# Altium schematic sheet Sheet1.SchDoc
size A4
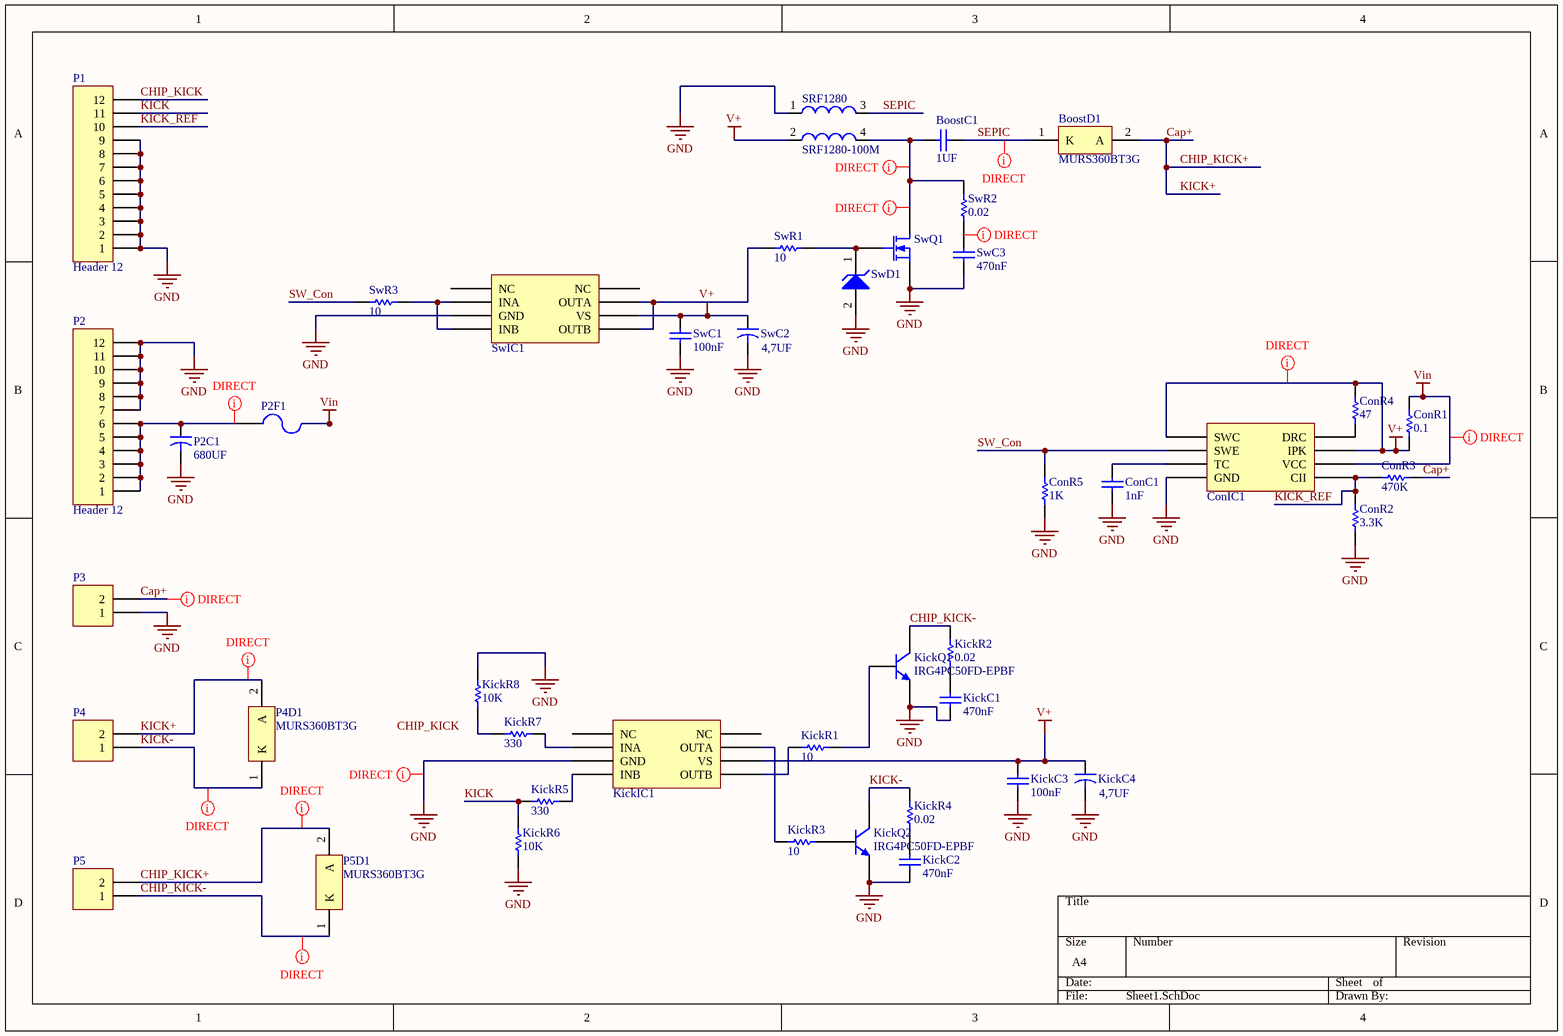
[diagram p0: Sheet1.SchDoc]

## Parts
BoostC1  value 1UF  [CAP-2220]  (hidden comment: CGA9P4X7T2W105M250KE)
BoostD1  MURS360BT3G  [ONSC-SMB-2-403A-03_V]
ConC1  value 1nF  [CAP-0402]  (hidden comment: GRM155R71H102KA01D)
ConIC1  MC34063ACD  [SOIC8-STM]  (value not drawn)
ConR1  value 0.1  [RES-2512 BOURNS CRA]  (hidden comment: CRA2512-FZ-R100ELF)
ConR2  value 3.3K  [RES-1206]  (hidden comment: RC1206JR-073K3L)
ConR3  value 470K  [RES-1206]  (hidden comment: RC1206FR-07470KL)
ConR4  value 47  [RES-0402]  (hidden comment: RC0402JR-0747RL)
ConR5  value 1K  [RES-0402]  (hidden comment: RC0402JR-071KL)
KickC1  value 470nF  [CAP-1812 TDK]  (hidden comment: C4532X7R2E474K230KA)
KickC2  value 470nF  [CAP-1812 TDK]  (hidden comment: C4532X7R2E474K230KA)
KickC3  value 100nF  [CAP-0402]  (hidden comment: GRM155R71C104KA88D)
KickC4  value 4,7UF  [CAP Tant 1206 Kemet]  (hidden comment: T491A475M025AT)
KickIC1  IR4427STRPBF  [SOIC8-INFINEON]  (value not drawn)
KickQ1  IRG4PC50FD-EPBF  [TO-247AC]
KickQ2  IRG4PC50FD-EPBF  [TO-247AC]
KickR1  value 10  [RES-0402]  (hidden comment: RC0402JR-0710RL)
KickR2  value 0.02  [RES-1206]  (hidden comment: PF1206FRF070R02L)
KickR3  value 10  [RES-0402]  (hidden comment: RC0402JR-0710RL)
KickR4  value 0.02  [RES-1206]  (hidden comment: PF1206FRF070R02L)
KickR5  value 330  [RES-0402]  (hidden comment: RC0402JR-07330RL)
KickR6  value 10K  [RES-0402]  (hidden comment: RC0402JR-0710KL)
KickR7  value 330  [RES-0402]  (hidden comment: RC0402JR-07330RL)
KickR8  value 10K  [RES-0402]  (hidden comment: RC0402JR-0710KL)
P1  Header 12  [HDR1X12]
P2  Header 12  [HDR1X12]
P2C1  value 680UF  [Cap Al Size G - Panasonic]  (hidden comment: EEE-FK1C681GP)
P2F1  MF-MSMF250/16X-2  [1812-MSMF Bourns2]  (value not drawn)
P3  OSTTA024163  [Term Block 2P]  (value not drawn)
P4  OSTTA024163  [Term Block 2P]  (value not drawn)
P4D1  MURS360BT3G  [ONSC-SMB-2-403A-03_V]
P5  OSTTA024163  [Term Block 2P]  (value not drawn)
P5D1  MURS360BT3G  [ONSC-SMB-2-403A-03_V]
SRF1280  SRF1280-100M  [SRF1280-100M-PCB]
SwC1  value 100nF  [CAP-0402]  (hidden comment: GRM155R71C104KA88D)
SwC2  value 4,7UF  [CAP Tant 1206 Kemet]  (hidden comment: T491A475M025AT)
SwC3  value 470nF  [CAP-1206 KEMET]  (hidden comment: C1206C474K5NACTU)
SwD1  MMSZ18T1G  [ONSC-SOD-123-2-425-04_V]  (value not drawn)
SwIC1  IR4427STRPBF  [SOIC8-INFINEON]  (value not drawn)
SwQ1  SUM45N25-58-E3  [TO-263 Vishay]  (value not drawn)
SwR1  value 10  [RES-0402]  (hidden comment: RC0402JR-0710RL)
SwR2  value 0.02  [RES-1206]  (hidden comment: PF1206FRF070R02L)
SwR3  value 10  [RES-0402]  (hidden comment: RC0402JR-0710RL)

## Nets
GND: ConC1.1 ConIC1.4(GND) ConR2.1 ConR5.1 KickC1.1 KickC2.1 KickC3.1 KickC4.2 KickIC1.3(GND) KickQ1.3(E) KickQ2.3(E) KickR6.1 KickR8.1 P1.1 P1.2 P1.3 P1.4 P1.5 P1.6 P1.7 P1.8 P1.9 P2.7 P2.8 P2.9 P2.10 P2.11 P2.12 P2C1.2 P3.1 SRF1280.1 SwC1.1 SwC2.2 SwC3.1 SwD1.2(A) SwIC1.3(GND) SwQ1.3(S)
V+: ConIC1.1(SWC) ConIC1.7(IPK) ConR1.1 ConR4.2 KickC3.2 KickC4.1 KickIC1.6(VS) SRF1280.2 SwC1.2 SwC2.1 SwIC1.6(VS)
Vin: ConIC1.6(VCC) ConR1.2 P2F1.2
Cap+: BoostD1.2(A) ConR3.2 P3.2 P4.2 P4D1.2(A) P5.2 P5D1.2(A)  [also labelled CHIP_KICK+, KICK+]
CHIP_KICK: P1.12
CHIP_KICK-: KickQ1.2(C) KickR2.2 P5.1 P5D1.1(K)
KICK: KickR5.1 KickR6.2 P1.11
KICK-: KickQ2.2(C) KickR4.2 P4.1 P4D1.1(K)
KICK_REF: ConIC1.5(CII) ConR2.2 ConR3.1 P1.10
SEPIC: BoostC1.2 BoostD1.1(K) SRF1280.3
SW_Con: ConIC1.2(SWE) ConR5.2 SwR3.1
NetBoostC1_1: BoostC1.1 SRF1280.4 SwQ1.2(D) SwR2.2
NetConC1_2: ConC1.2 ConIC1.3(TC)
NetConIC1_8: ConIC1.8(DRC) ConR4.1
NetKickC1_2: KickC1.2 KickR2.1
NetKickC2_2: KickC2.2 KickR4.1
NetKickIC1_2: KickIC1.2(INA) KickR7.2
NetKickIC1_4: KickIC1.4(INB) KickR5.2
NetKickIC1_5: KickIC1.5(OUTB) KickR1.1
NetKickIC1_7: KickIC1.7(OUTA) KickR3.1
NetKickQ1_1: KickQ1.1(B) KickR1.2
NetKickQ2_1: KickQ2.1(B) KickR3.2
NetKickR7_1: KickR7.1 KickR8.2
NetP2_1: P2.1 P2.2 P2.3 P2.4 P2.5 P2.6 P2C1.1 P2F1.1
NetSwC3_2: SwC3.2 SwR2.1
NetSwD1_1: SwD1.1(K) SwQ1.1(G) SwR1.2
NetSwIC1_2: SwIC1.2(INA) SwIC1.4(INB) SwR3.2
NetSwIC1_5: SwIC1.5(OUTB) SwIC1.7(OUTA) SwR1.1

Not connected (* = marked no-connect by the designer): KickIC1 1(NC) 8(NC); SwIC1 1(NC) 8(NC)

## Layout directives
net class DIRECT: Cap+, CHIP_KICK-, GND, KICK-, NetBoostC1_1, NetP2_1, NetSwC3_2, SEPIC, V+, Vin

## Notes on the sheet
- Labels drawn without touching a wire or pin: CHIP_KICK

## Library data of the parts
BoostC1 = Cap 1UF 2220 450V: 1µF 450V Ceramic Capacitor X7T 2220 (5750 Metric) 0.224" L x 0.197" W (5.70mm x 5.00mm)
BoostD1 P4D1 P5D1 = CMP-0902-00327-1: Surface Mount Ultrafast Power Rectifier, 2-Pin SMB, Pb-Free, Tape and Reel; Manufacturer: On Semiconductor; VRRM Max (V): 600; IFSM Max (A): 100; PackageVersion: Rev. J, 07/2012; ComponentLink3Description: Package Specification; ComponentLink2URL: http://www.onsemi.cn/pub_link/Collateral/MURS360BT3-D.PDF; PackageDescription: 2-Pin Small Molded Package, J-Bend Lead, Body 4.33 x 3.625 mm; Type: Ultrafast; RoHS: TRUE; Mounting Technology: Surface Mount; Packing: Tape and Reel; ComponentLink2Description: Datasheet; ComponentLink1URL: http://www.onsemi.com/; DatasheetVersion: Rev. 5; PartNumber: MURS360BT3G; ComponentLink3URL: http://www.onsemi.com/pub_link/Collateral/403A-03.PDF; PackageReference: SMB-2-403A-03; ComponentLink1Description: Manufacturer URL
ConC1 = Cap 1nF 0402: 1000pF 50V Ceramic Capacitor X7R 0402 (1005 Metric) 0.039" L x 0.020" W (1.00mm x 0.50mm)
ConIC1 = MC34063ACD: Buck, Boost Switching Regulator IC Positive or Negative Adjustable 1.25V 1 Output 1.5A (Switch) 8-SOIC (0.154", 3.90mm Width)
ConR1 = RES 0R1 2512: RES SMD 0.1 OHM 1% 3W 2512
ConR2 = RES 3.3K 1206: RES SMD 3.3K OHM 5% 1/4W 1206
ConR3 = RES 470K 1206: RES SMD 470K OHM 1% 1/4W 1206
ConR4 = RES 47 0402: RES SMD 47 OHM 5% 1/16W 0402
ConR5 = RES 1K 0402: RES SMD 1K OHM 5% 1/16W 0402
KickC1 KickC2 = Cap 470nF 250V 1812: 0.47µF 250V Ceramic Capacitor X7R 1812 (4532 Metric) 0.177" L x 0.126" W (4.50mm x 3.20mm)
KickC3 SwC1 = Cap 100nF 0402: 0.10µF 16V Ceramic Capacitor X7R 0402 (1005 Metric) 0.039" L x 0.020" W (1.00mm x 0.50mm)
KickC4 SwC2 = Cap Tant 4,7UF 1206: 4.7µF Molded Tantalum Capacitors 25V 1206 (3216 Metric) 6 Ohm 0.126" L x 0.063" W (3.20mm x 1.60mm)
KickIC1 SwIC1 = IR4427: IC DRIVER DUAL LOW SIDE 8SOIC
KickQ1 KickQ2 = IRG4PC50FD: IGBT 600V 70A 200W TO247AD
KickR1 KickR3 SwR1 SwR3 = RES 10 0402: RES SMD 10 OHM 5% 1/16W 0402
KickR2 KickR4 SwR2 = RES 0R02 1206: RES SMD 0.02 OHM 1% 1/4W 1206
KickR5 KickR7 = RES 330 0402: RES SMD 330 OHM 5% 1/16W 0402
KickR6 KickR8 = RES 10K 0402: RES SMD 10K OHM 5% 1/16W 0402
P1 P2 = Header 12: Header, 12-Pin; LatestRevisionDate: 17-Jul-2002; LatestRevisionNote: Re-released for DXP Platform.; Publisher: Altium Limited
P2C1 = CAP AL 680UF/16V: Aluminum Electrolytic Capacitors - SMD Al Lytic Cap SMT FK Series 105C
P2F1 = MF-MSMF250/16X: PTC RESETTABLE
P3-P5 = Term Block 2P: 2 Position Wire to Board Terminal Block Horizontal with Board 0.200" (5.08mm) Through Hole
SRF1280 = SRF1280-100M: Shielded 2 Coil Inductor Array 40µH Inductance - Connected in Series 10µH Inductance - Connected in Parallel 24.1 mOhm Max DC Resistance (DCR) - Parallel 6.04A Nonstandard
SwC3 = Cap 470nF 50V 1206: 0.47µF 50V Ceramic Capacitor X8L 1206 (3216 Metric) 0.126" L x 0.063" W (3.20mm x 1.60mm)
SwD1 = CMP-1060-00279-1: Zener Voltage Regulator, 500 mW, 2-Pin SOD-123, Pb-Free, Tape and Reel; Manufacturer: On Semiconductor; P Max (W): 0.5; Mounting Technology: Surface Mount; RoHS: Pb-Free; PartNumber: MMSZ18T1G; ComponentLink1URL: http://www.onsemi.com/; PackageDescription: 2-Pin SOD, Body 1.6 x 2.69 mm; ComponentLink1Description: Manufacturer URL; ComponentLink3Description: Package Specification; ComponentLink3URL: http://www.onsemi.com/pub_link/Collateral/425-04.PDF; PackageVersion: Rev. G, 10/2009; Packing: Tape and Reel; ComponentLink2Description: Datasheet; PackageReference: SOD-123-2-425-04; ComponentLink2URL: http://www.onsemi.com/pub_link/Collateral/MMSZ2V4T1-D.PDF; DatasheetVersion: Rev. 11
SwQ1 = SUM45N25: MOSFET N-CH 250V 45A D2PAK